# Altium schematic sheet 17_CAM_Connector.SchDoc: C200
size 594 x 420 mm; Page Create Date: March  8, 1995; Page Number: 17; Page Size: A2; Comment: radxa_1010; Page Count: 21; RevCode: V1.11; Doc: 17_CAM_Connector; DsnPath: D:\WMS\C200\CC122\对外\C200 V1.11.DSN; SchematicName: c200; PageName: 17_CAM_Connector; PageSize: A2; TopSchematic: True
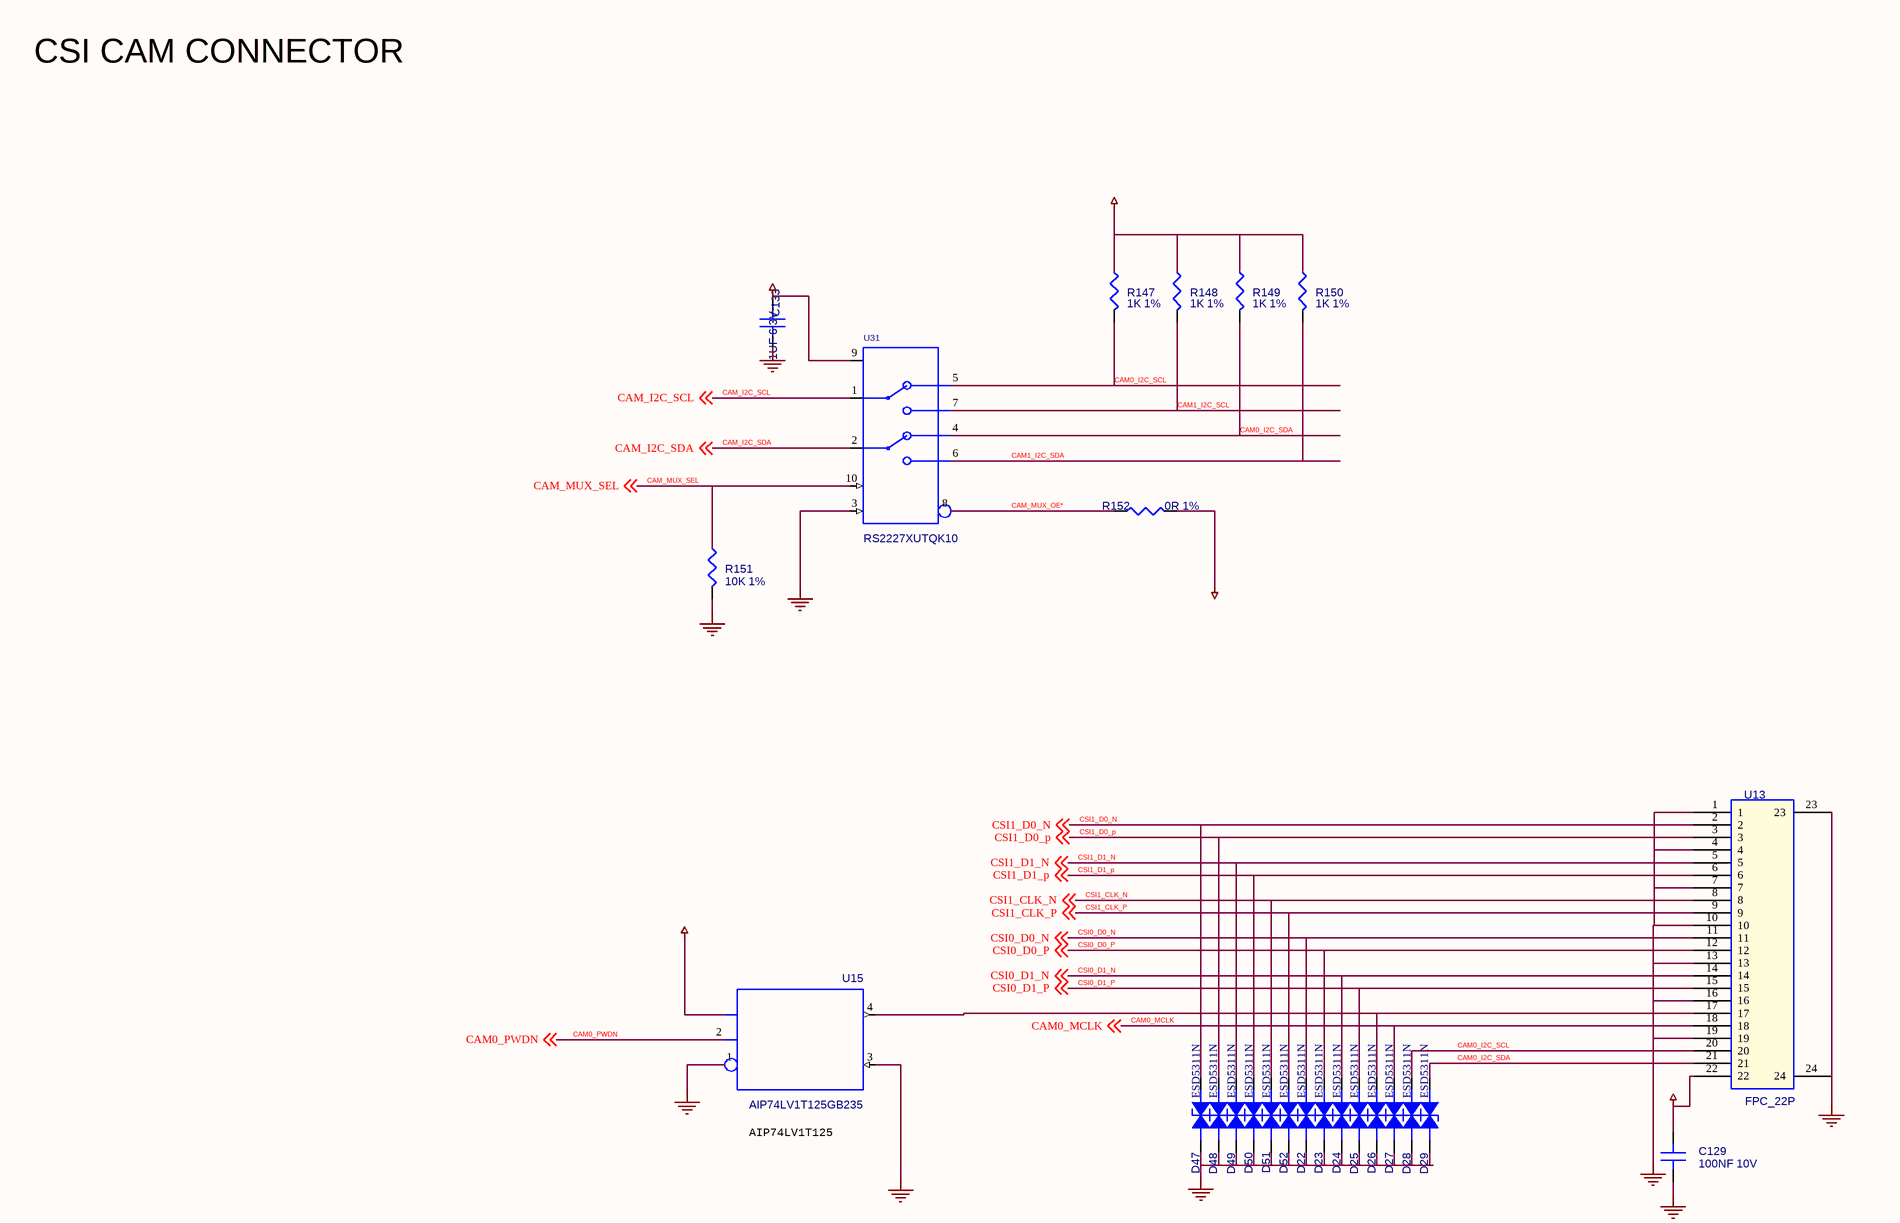
[diagram p0: 17_CAM_Connector.SchDoc, top left]
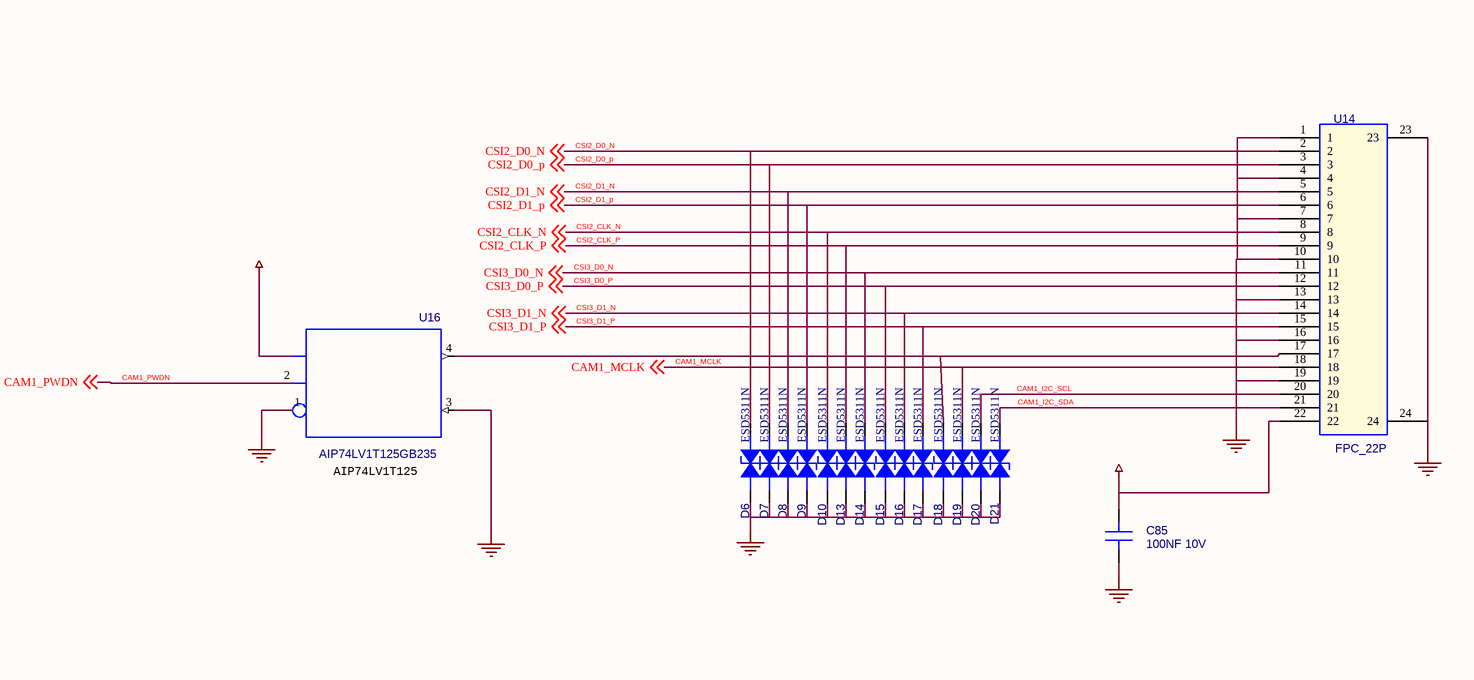
[diagram p1: 17_CAM_Connector.SchDoc, bottom left]
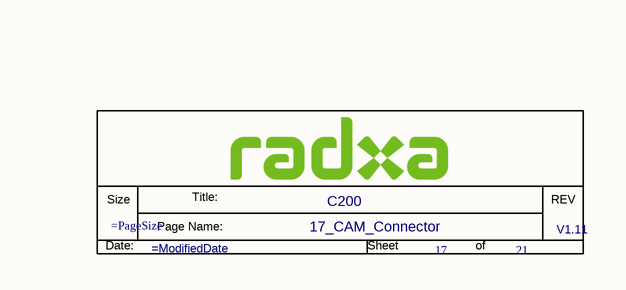
[diagram p2: 17_CAM_Connector.SchDoc, bottom right]

## Parts
*  Doc: 17_CAM_Connector  RevCode: V1.11  Title: C200  Page Number: 17  Page Count: 21  (hidden comment: radxa_1010)  (graphical)
C85  100NF 10V  [C0402]
C129  100NF 10V  [C0402]
C133  1UF 6.3V  [C0201]
D6  ESD5311N  [DFN1006-2L]
D7  ESD5311N  [DFN1006-2L]
D8  ESD5311N  [DFN1006-2L]
D9  ESD5311N  [DFN1006-2L]
D10  ESD5311N  [DFN1006-2L]
D13  ESD5311N  [DFN1006-2L]
D14  ESD5311N  [DFN1006-2L]
D15  ESD5311N  [DFN1006-2L]
D16  ESD5311N  [DFN1006-2L]
D17  ESD5311N  [DFN1006-2L]
D18  ESD5311N  [DFN1006-2L]
D19  ESD5311N  [DFN1006-2L]
D20  ESD5311N  [DFN1006-2L]
D21  ESD5311N  [DFN1006-2L]
D22  ESD5311N  [DFN1006-2L]
D23  ESD5311N  [DFN1006-2L]
D24  ESD5311N  [DFN1006-2L]
D25  ESD5311N  [DFN1006-2L]
D26  ESD5311N  [DFN1006-2L]
D27  ESD5311N  [DFN1006-2L]
D28  ESD5311N  [DFN1006-2L]
D29  ESD5311N  [DFN1006-2L]
D47  ESD5311N  [DFN1006-2L]
D48  ESD5311N  [DFN1006-2L]
D49  ESD5311N  [DFN1006-2L]
D50  ESD5311N  [DFN1006-2L]
D51  ESD5311N  [DFN1006-2L]
D52  ESD5311N  [DFN1006-2L]
R147  1K 1%  [R0402]
R148  1K 1%  [R0402]
R149  1K 1%  [R0402]
R150  1K 1%  [R0402]
R151  10K 1%  [R0402]
R152  0R 1%  [R0402]
U13  FPC_22P  [FPC_22_0D5_LIE_FG]
U14  FPC_22P  [FPC_22_0D5_LIE_FG]
U15  AIP74LV1T125GB235  [SC70_5]
U16  AIP74LV1T125GB235  [SC70_5]
U31  RS2227XUTQK10  [QFN10_0D4_1D4]

## Nets
GND: C85.2(B) C129.2(B) C133.2(B) D6.2(CATHODE) D7.2(CATHODE) D8.2(CATHODE) D9.2(CATHODE) D10.2(CATHODE) D13.2(CATHODE) D14.2(CATHODE) D15.2(CATHODE) D16.2(CATHODE) D17.2(CATHODE) D18.2(CATHODE) D19.2(CATHODE) D20.2(CATHODE) D21.2(CATHODE) D22.2(CATHODE) D23.2(CATHODE) D24.2(CATHODE) D25.2(CATHODE) D26.2(CATHODE) D27.2(CATHODE) D28.2(CATHODE) D29.2(CATHODE) D47.2(CATHODE) D48.2(CATHODE) D49.2(CATHODE) D50.2(CATHODE) D51.2(CATHODE) D52.2(CATHODE) R151.2 R152.2 U13.1 U13.4 U13.7 U13.10 U13.13 U13.16 U13.19 U13.23 U13.24 U14.1 U14.4 U14.7 U14.10 U14.13 U14.16 U14.19 U14.23 U14.24 U15.1(OE*) U15.3(GND) U16.1(OE*) U16.3(GND) U31.3(GND)
VCC: U15.5(VCC) U16.5(VCC)
VDD_3V3_SYS: C85.1(A) C129.1(A) C133.1(A) R147.1 R148.1 R149.1 R150.1 U13.22 U14.22 U31.9(VCC)
CAM0_I2C_SCL: D28.1(ANODE) R147.2 U13.20 U31.5(HSD1P)
CAM0_I2C_SDA: D29.1(ANODE) R149.2 U13.21 U31.4(HSD1N)
CAM0_MCLK: D27.1(ANODE) U13.18 ; off-sheet CAM0_MCLK
CAM0_PWDN: U15.2(IN) ; off-sheet CAM0_PWDN
CAM1_I2C_SCL: D20.1(ANODE) R148.2 U14.20 U31.7(HSD2P)
CAM1_I2C_SDA: D21.1(ANODE) R150.2 U14.21 U31.6(HSD2N)
CAM1_MCLK: D19.1(ANODE) U14.18 ; off-sheet CAM1_MCLK
CAM1_PWDN: U16.2(IN) ; off-sheet CAM1_PWDN
CAM_I2C_SCL: U31.1(DP) ; off-sheet CAM_I2C_SCL
CAM_I2C_SDA: U31.2(DN) ; off-sheet CAM_I2C_SDA
CAM_MUX_OE*: R152.1 U31.8(OE*)
CAM_MUX_SEL: R151.1 U31.10(S) ; off-sheet CAM_MUX_SEL
CSI0_D0_N: D22.1(ANODE) U13.11 ; off-sheet CSI0_D0_N
CSI0_D0_P: D23.1(ANODE) U13.12 ; off-sheet CSI0_D0_P
CSI0_D1_N: D24.1(ANODE) U13.14 ; off-sheet CSI0_D1_N
CSI0_D1_P: D25.1(ANODE) U13.15 ; off-sheet CSI0_D1_P
CSI1_CLK_N: D51.1(ANODE) U13.8 ; off-sheet CSI1_CLK_N
CSI1_CLK_P: D52.1(ANODE) U13.9 ; off-sheet CSI1_CLK_P
CSI1_D0_N: D47.1(ANODE) U13.2 ; off-sheet CSI1_D0_N
CSI1_D0_p: D48.1(ANODE) U13.3 ; off-sheet CSI1_D0_p
CSI1_D1_N: D49.1(ANODE) U13.5 ; off-sheet CSI1_D1_N
CSI1_D1_p: D50.1(ANODE) U13.6 ; off-sheet CSI1_D1_p
CSI2_CLK_N: D10.1(ANODE) U14.8 ; off-sheet CSI2_CLK_N
CSI2_CLK_P: D13.1(ANODE) U14.9 ; off-sheet CSI2_CLK_P
CSI2_D0_N: D6.1(ANODE) U14.2 ; off-sheet CSI2_D0_N
CSI2_D0_p: D7.1(ANODE) U14.3 ; off-sheet CSI2_D0_p
CSI2_D1_N: D8.1(ANODE) U14.5 ; off-sheet CSI2_D1_N
CSI2_D1_p: D9.1(ANODE) U14.6 ; off-sheet CSI2_D1_p
CSI3_D0_N: D14.1(ANODE) U14.11 ; off-sheet CSI3_D0_N
CSI3_D0_P: D15.1(ANODE) U14.12 ; off-sheet CSI3_D0_P
CSI3_D1_N: D16.1(ANODE) U14.14 ; off-sheet CSI3_D1_N
CSI3_D1_P: D17.1(ANODE) U14.15 ; off-sheet CSI3_D1_P
NetD18_1: D18.1(ANODE) U14.17 U16.4(OUT)
NetD26_1: D26.1(ANODE) U13.17 U15.4(OUT)

## Notes on the sheet
- CSI CAM CONNECTOR
- AIP74LV1T125
- (in symbol radxa_1010) Size; Title:; REV; Page Name:; Date:; Sheet; of

## Library data of the parts
C85 = C: SMD  0402  100NF  10V  X5R  ±10%  ROHS; PARTS: 1; Part Reference: C85; Part Number: A1C01.00163; OriginalSymbolOrigin: (0,30); PKG_TYPE: CAP2-100-250; LEVEL: STD; PINSWAP: (A,B); Value: 100NF 10V; Part Type: 陶瓷电容; PCB Footprint: C0402
C129 = C: SMD  0402  100NF  10V  X5R  ±10%  ROHS; PARTS: 1; Part Reference: C129; Part Number: A1C01.00163; OriginalSymbolOrigin: (0,30); PKG_TYPE: CAP2-100-250; LEVEL: STD; PINSWAP: (A,B); Value: 100NF 10V; Part Type: 陶瓷电容; PCB Footprint: C0402
C133 = C: SMD  0201  1UF  6.3V  X5R  ±20%  ROHS; PARTS: 1; Part Reference: C133; Part Number: A1C01.00083; OriginalSymbolOrigin: (0,30); PKG_TYPE: CAP2-100-250; LEVEL: STD; PINSWAP: (A,B); Value: 1UF 6.3V; Part Type: 陶瓷电容; PCB Footprint: C0201
D6 = ESD: SMD  编带  DFN1006-2L  ESD5311N-2/TR  双向TVS  VRWM=5V  0.25pF  84W  WILLSEMI(韦尔)  ROHS; Part Reference: D6; Part Number: A1D02.00001; Parameter: ESD-台舟 ESD5341N-封装 esd0402; Temp Coeff: -40℃ to +125℃; Value: ESD5311N; Part Type: 二极管-ESD管-桥堆-TVS管; PCB Footprint: DFN1006-2L
D7 = ESD: SMD  编带  DFN1006-2L  ESD5311N-2/TR  双向TVS  VRWM=5V  0.25pF  84W  WILLSEMI(韦尔)  ROHS; Part Reference: D7; Part Number: A1D02.00001; Parameter: ESD-台舟 ESD5341N-封装 esd0402; ID: DE-E0004; Temp Coeff: -40℃ to +125℃; Value: ESD5311N; Part Type: 二极管-ESD管-桥堆-TVS管; PCB Footprint: DFN1006-2L
D8 = ESD: SMD  编带  DFN1006-2L  ESD5311N-2/TR  双向TVS  VRWM=5V  0.25pF  84W  WILLSEMI(韦尔)  ROHS; Part Reference: D8; Part Number: A1D02.00001; Parameter: ESD-台舟 ESD5341N-封装 esd0402; ID: DE-E0004; Temp Coeff: -40℃ to +125℃; Value: ESD5311N; Part Type: 二极管-ESD管-桥堆-TVS管; PCB Footprint: DFN1006-2L
D9 = ESD: SMD  编带  DFN1006-2L  ESD5311N-2/TR  双向TVS  VRWM=5V  0.25pF  84W  WILLSEMI(韦尔)  ROHS; Part Reference: D9; Part Number: A1D02.00001; Parameter: ESD-台舟 ESD5341N-封装 esd0402; ID: DE-E0004; Temp Coeff: -40℃ to +125℃; Value: ESD5311N; Part Type: 二极管-ESD管-桥堆-TVS管; PCB Footprint: DFN1006-2L
D10 = ESD: SMD  编带  DFN1006-2L  ESD5311N-2/TR  双向TVS  VRWM=5V  0.25pF  84W  WILLSEMI(韦尔)  ROHS; Part Reference: D10; Part Number: A1D02.00001; Parameter: ESD-台舟 ESD5341N-封装 esd0402; Temp Coeff: -40℃ to +125℃; Value: ESD5311N; Part Type: 二极管-ESD管-桥堆-TVS管; PCB Footprint: DFN1006-2L
D13 = ESD: SMD  编带  DFN1006-2L  ESD5311N-2/TR  双向TVS  VRWM=5V  0.25pF  84W  WILLSEMI(韦尔)  ROHS; Part Reference: D13; Part Number: A1D02.00001; Parameter: ESD-台舟 ESD5341N-封装 esd0402; ID: DE-E0004; Temp Coeff: -40℃ to +125℃; Value: ESD5311N; Part Type: 二极管-ESD管-桥堆-TVS管; PCB Footprint: DFN1006-2L
D14 = ESD: SMD  编带  DFN1006-2L  ESD5311N-2/TR  双向TVS  VRWM=5V  0.25pF  84W  WILLSEMI(韦尔)  ROHS; Part Reference: D14; Part Number: A1D02.00001; Parameter: ESD-台舟 ESD5341N-封装 esd0402; ID: DE-E0004; Temp Coeff: -40℃ to +125℃; Value: ESD5311N; Part Type: 二极管-ESD管-桥堆-TVS管; PCB Footprint: DFN1006-2L
D15 = ESD: SMD  编带  DFN1006-2L  ESD5311N-2/TR  双向TVS  VRWM=5V  0.25pF  84W  WILLSEMI(韦尔)  ROHS; Part Reference: D15; Part Number: A1D02.00001; Parameter: ESD-台舟 ESD5341N-封装 esd0402; Temp Coeff: -40℃ to +125℃; Value: ESD5311N; Part Type: 二极管-ESD管-桥堆-TVS管; PCB Footprint: DFN1006-2L
D16 = ESD: SMD  编带  DFN1006-2L  ESD5311N-2/TR  双向TVS  VRWM=5V  0.25pF  84W  WILLSEMI(韦尔)  ROHS; Part Reference: D16; Part Number: A1D02.00001; Parameter: ESD-台舟 ESD5341N-封装 esd0402; ID: DE-E0004; Temp Coeff: -40℃ to +125℃; Value: ESD5311N; Part Type: 二极管-ESD管-桥堆-TVS管; PCB Footprint: DFN1006-2L
D17 = ESD: SMD  编带  DFN1006-2L  ESD5311N-2/TR  双向TVS  VRWM=5V  0.25pF  84W  WILLSEMI(韦尔)  ROHS; Part Reference: D17; Part Number: A1D02.00001; Parameter: ESD-台舟 ESD5341N-封装 esd0402; ID: DE-E0004; Temp Coeff: -40℃ to +125℃; Value: ESD5311N; Part Type: 二极管-ESD管-桥堆-TVS管; PCB Footprint: DFN1006-2L
D18 = ESD: SMD  编带  DFN1006-2L  ESD5311N-2/TR  双向TVS  VRWM=5V  0.25pF  84W  WILLSEMI(韦尔)  ROHS; Part Reference: D18; Part Number: A1D02.00001; Parameter: ESD-台舟 ESD5341N-封装 esd0402; Temp Coeff: -40℃ to +125℃; Value: ESD5311N; Part Type: 二极管-ESD管-桥堆-TVS管; PCB Footprint: DFN1006-2L
D19 = ESD: SMD  编带  DFN1006-2L  ESD5311N-2/TR  双向TVS  VRWM=5V  0.25pF  84W  WILLSEMI(韦尔)  ROHS; Part Reference: D19; Part Number: A1D02.00001; Parameter: ESD-台舟 ESD5341N-封装 esd0402; ID: DE-E0004; Temp Coeff: -40℃ to +125℃; Value: ESD5311N; Part Type: 二极管-ESD管-桥堆-TVS管; PCB Footprint: DFN1006-2L
D20 = ESD: SMD  编带  DFN1006-2L  ESD5311N-2/TR  双向TVS  VRWM=5V  0.25pF  84W  WILLSEMI(韦尔)  ROHS; Part Reference: D20; Part Number: A1D02.00001; Parameter: ESD-台舟 ESD5341N-封装 esd0402; Temp Coeff: -40℃ to +125℃; Value: ESD5311N; Part Type: 二极管-ESD管-桥堆-TVS管; PCB Footprint: DFN1006-2L
D21 = ESD: SMD  编带  DFN1006-2L  ESD5311N-2/TR  双向TVS  VRWM=5V  0.25pF  84W  WILLSEMI(韦尔)  ROHS; Part Reference: D21; Part Number: A1D02.00001; Parameter: ESD-台舟 ESD5341N-封装 esd0402; ID: DE-E0004; Temp Coeff: -40℃ to +125℃; Value: ESD5311N; Part Type: 二极管-ESD管-桥堆-TVS管; PCB Footprint: DFN1006-2L
D22 = ESD: SMD  编带  DFN1006-2L  ESD5311N-2/TR  双向TVS  VRWM=5V  0.25pF  84W  WILLSEMI(韦尔)  ROHS; Part Reference: D22; Part Number: A1D02.00001; Parameter: ESD-台舟 ESD5341N-封装 esd0402; Temp Coeff: -40℃ to +125℃; Value: ESD5311N; Part Type: 二极管-ESD管-桥堆-TVS管; PCB Footprint: DFN1006-2L
D23 = ESD: SMD  编带  DFN1006-2L  ESD5311N-2/TR  双向TVS  VRWM=5V  0.25pF  84W  WILLSEMI(韦尔)  ROHS; Part Reference: D23; Part Number: A1D02.00001; Parameter: ESD-台舟 ESD5341N-封装 esd0402; ID: DE-E0004; Temp Coeff: -40℃ to +125℃; Value: ESD5311N; Part Type: 二极管-ESD管-桥堆-TVS管; PCB Footprint: DFN1006-2L
D24 = ESD: SMD  编带  DFN1006-2L  ESD5311N-2/TR  双向TVS  VRWM=5V  0.25pF  84W  WILLSEMI(韦尔)  ROHS; Part Reference: D24; Part Number: A1D02.00001; Parameter: ESD-台舟 ESD5341N-封装 esd0402; ID: DE-E0004; Temp Coeff: -40℃ to +125℃; Value: ESD5311N; Part Type: 二极管-ESD管-桥堆-TVS管; PCB Footprint: DFN1006-2L
D25 = ESD: SMD  编带  DFN1006-2L  ESD5311N-2/TR  双向TVS  VRWM=5V  0.25pF  84W  WILLSEMI(韦尔)  ROHS; Part Reference: D25; Part Number: A1D02.00001; Parameter: ESD-台舟 ESD5341N-封装 esd0402; ID: DE-E0004; Temp Coeff: -40℃ to +125℃; Value: ESD5311N; Part Type: 二极管-ESD管-桥堆-TVS管; PCB Footprint: DFN1006-2L
D26 = ESD: SMD  编带  DFN1006-2L  ESD5311N-2/TR  双向TVS  VRWM=5V  0.25pF  84W  WILLSEMI(韦尔)  ROHS; Part Reference: D26; Part Number: A1D02.00001; Parameter: ESD-台舟 ESD5341N-封装 esd0402; Temp Coeff: -40℃ to +125℃; Value: ESD5311N; Part Type: 二极管-ESD管-桥堆-TVS管; PCB Footprint: DFN1006-2L
D27 = ESD: SMD  编带  DFN1006-2L  ESD5311N-2/TR  双向TVS  VRWM=5V  0.25pF  84W  WILLSEMI(韦尔)  ROHS; Part Reference: D27; Part Number: A1D02.00001; Parameter: ESD-台舟 ESD5341N-封装 esd0402; ID: DE-E0004; Temp Coeff: -40℃ to +125℃; Value: ESD5311N; Part Type: 二极管-ESD管-桥堆-TVS管; PCB Footprint: DFN1006-2L
D28 = ESD: SMD  编带  DFN1006-2L  ESD5311N-2/TR  双向TVS  VRWM=5V  0.25pF  84W  WILLSEMI(韦尔)  ROHS; Part Reference: D28; Part Number: A1D02.00001; Parameter: ESD-台舟 ESD5341N-封装 esd0402; Temp Coeff: -40℃ to +125℃; Value: ESD5311N; Part Type: 二极管-ESD管-桥堆-TVS管; PCB Footprint: DFN1006-2L
D29 = ESD: SMD  编带  DFN1006-2L  ESD5311N-2/TR  双向TVS  VRWM=5V  0.25pF  84W  WILLSEMI(韦尔)  ROHS; Part Reference: D29; Part Number: A1D02.00001; Parameter: ESD-台舟 ESD5341N-封装 esd0402; ID: DE-E0004; Temp Coeff: -40℃ to +125℃; Value: ESD5311N; Part Type: 二极管-ESD管-桥堆-TVS管; PCB Footprint: DFN1006-2L
D47 = ESD: SMD  编带  DFN1006-2L  ESD5311N-2/TR  双向TVS  VRWM=5V  0.25pF  84W  WILLSEMI(韦尔)  ROHS; Part Reference: D47; Part Number: A1D02.00001; Parameter: ESD-台舟 ESD5341N-封装 esd0402; Temp Coeff: -40℃ to +125℃; Value: ESD5311N; Part Type: 二极管-ESD管-桥堆-TVS管; PCB Footprint: DFN1006-2L
D48 = ESD: SMD  编带  DFN1006-2L  ESD5311N-2/TR  双向TVS  VRWM=5V  0.25pF  84W  WILLSEMI(韦尔)  ROHS; Part Reference: D48; Part Number: A1D02.00001; Parameter: ESD-台舟 ESD5341N-封装 esd0402; ID: DE-E0004; Temp Coeff: -40℃ to +125℃; Value: ESD5311N; Part Type: 二极管-ESD管-桥堆-TVS管; PCB Footprint: DFN1006-2L
D49 = ESD: SMD  编带  DFN1006-2L  ESD5311N-2/TR  双向TVS  VRWM=5V  0.25pF  84W  WILLSEMI(韦尔)  ROHS; Part Reference: D49; Part Number: A1D02.00001; Parameter: ESD-台舟 ESD5341N-封装 esd0402; ID: DE-E0004; Temp Coeff: -40℃ to +125℃; Value: ESD5311N; Part Type: 二极管-ESD管-桥堆-TVS管; PCB Footprint: DFN1006-2L
D50 = ESD: SMD  编带  DFN1006-2L  ESD5311N-2/TR  双向TVS  VRWM=5V  0.25pF  84W  WILLSEMI(韦尔)  ROHS; Part Reference: D50; Part Number: A1D02.00001; Parameter: ESD-台舟 ESD5341N-封装 esd0402; ID: DE-E0004; Temp Coeff: -40℃ to +125℃; Value: ESD5311N; Part Type: 二极管-ESD管-桥堆-TVS管; PCB Footprint: DFN1006-2L
D51 = ESD: SMD  编带  DFN1006-2L  ESD5311N-2/TR  双向TVS  VRWM=5V  0.25pF  84W  WILLSEMI(韦尔)  ROHS; Part Reference: D51; Part Number: A1D02.00001; Parameter: ESD-台舟 ESD5341N-封装 esd0402; Temp Coeff: -40℃ to +125℃; Value: ESD5311N; Part Type: 二极管-ESD管-桥堆-TVS管; PCB Footprint: DFN1006-2L
D52 = ESD: SMD  编带  DFN1006-2L  ESD5311N-2/TR  双向TVS  VRWM=5V  0.25pF  84W  WILLSEMI(韦尔)  ROHS; Part Reference: D52; Part Number: A1D02.00001; Parameter: ESD-台舟 ESD5341N-封装 esd0402; ID: DE-E0004; Temp Coeff: -40℃ to +125℃; Value: ESD5311N; Part Type: 二极管-ESD管-桥堆-TVS管; PCB Footprint: DFN1006-2L
R147 = R: SMD  0201  1K  1/20W  ±1%  ROHS; Part Reference: R147; Part Number: A1R01.00111; CDS_PART_NAME: R_0402-47K,5 %,62.5MW,195-0599-000; CDS_PHYS_PART_NAME: R_0402-47K,5 %,62.5MW,195-0599-000-195-0599-000,47K; PCB Footprint: R0201; ASSEMBLY: CAM; CDS_LIB: discrete; CDS_SEC: 1; DEVICE_TYPENAME: R_0402-47K5625MW195-0599-000-195-0599-00047K; DRAWING: @P3449_B01_LIB.P3449_B01(SCH_1):PAGE18; MAX_WATTAGE: 62.5mW; NV_PN: 195-0599-000; PACK_TYPE: 402; PATH: I86; PHYS_PAGE: 18; ROT: 0; SIGNAL_MODEL: nv_res; TOL: 5%; VER: 2; XY: (-9200,2300); Value: 1K 1%; Part Type: 贴片电阻; CHIPS_PART_NAME: R; SEC: 1
R148 = R: SMD  0201  1K  1/20W  ±1%  ROHS; Part Reference: R148; CDS_PHYS_PART_NAME: R_0402-47K,5 %,62.5MW,195-0599-000-195-0599-000,47K; CDS_PART_NAME: R_0402-47K,5 %,62.5MW,195-0599-000; Part Number: A1R01.00111; PCB Footprint: R0201; SEC: 1; XY: (-8950,2300); VER: 2; TOL: 5%; SIGNAL_MODEL: nv_res; ROT: 0; PHYS_PAGE: 18; PATH: I87; PACK_TYPE: 402; NV_PN: 195-0599-000; MAX_WATTAGE: 62.5mW; DRAWING: @P3449_B01_LIB.P3449_B01(SCH_1):PAGE18; DEVICE_TYPENAME: R_0402-47K5625MW195-0599-000-195-0599-00047K; CDS_LIB: discrete; ASSEMBLY: CAM; Value: 1K 1%; CHIPS_PART_NAME: R; CDS_SEC: 1; Part Type: 贴片电阻
R149 = R: SMD  0201  1K  1/20W  ±1%  ROHS; Part Reference: R149; CDS_PHYS_PART_NAME: R_0402-47K,5 %,62.5MW,195-0599-000-195-0599-000,47K; CDS_PART_NAME: R_0402-47K,5 %,62.5MW,195-0599-000; Part Number: A1R01.00111; PCB Footprint: R0201; SEC: 1; XY: (-8700,2300); VER: 2; TOL: 5%; SIGNAL_MODEL: nv_res; ROT: 0; PHYS_PAGE: 18; PATH: I88; PACK_TYPE: 402; NV_PN: 195-0599-000; MAX_WATTAGE: 62.5mW; DRAWING: @P3449_B01_LIB.P3449_B01(SCH_1):PAGE18; DEVICE_TYPENAME: R_0402-47K5625MW195-0599-000-195-0599-00047K; CDS_LIB: discrete; ASSEMBLY: CAM; Value: 1K 1%; CHIPS_PART_NAME: R; CDS_SEC: 1; Part Type: 贴片电阻
R150 = R: SMD  0201  1K  1/20W  ±1%  ROHS; Part Reference: R150; CDS_PHYS_PART_NAME: R_0402-47K,5 %,62.5MW,195-0599-000-195-0599-000,47K; CDS_PART_NAME: R_0402-47K,5 %,62.5MW,195-0599-000; Part Number: A1R01.00111; PCB Footprint: R0201; SEC: 1; XY: (-8450,2300); VER: 2; TOL: 5%; SIGNAL_MODEL: nv_res; ROT: 0; PHYS_PAGE: 18; PATH: I89; PACK_TYPE: 402; NV_PN: 195-0599-000; MAX_WATTAGE: 62.5mW; DRAWING: @P3449_B01_LIB.P3449_B01(SCH_1):PAGE18; DEVICE_TYPENAME: R_0402-47K5625MW195-0599-000-195-0599-00047K; CDS_LIB: discrete; ASSEMBLY: CAM; Value: 1K 1%; CHIPS_PART_NAME: R; CDS_SEC: 1; Part Type: 贴片电阻
R151 = R: SMD  0402  10K  1/16W  ±1%  ROHS; Part Reference: R151; Part Number: A1R01.00222; CDS_PART_NAME: R_0402-10K,5 %,62.5MW,195-0486-000; CDS_PHYS_PART_NAME: R_0402-10K,5 %,62.5MW,195-0486-000-10K,195-0486-000; ASSEMBLY: CAM; CDS_LIB: discrete; CDS_SEC: 1; DEVICE_TYPENAME: R_0402-10K5625MW195-0486-000-10K195-0486-000; DRAWING: @P3449_B01_LIB.P3449_B01(SCH_1):PAGE18; MAX_WATTAGE: 62.5mW; NV_PN: 195-0486-000; PACK_TYPE: 402; PATH: I92; PHYS_PAGE: 18; ROT: 0; SIGNAL_MODEL: nv_res; TOL: 5%; VER: 2; XY: (-10850,1350); PCB Footprint: R0402; Value: 10K 1%; Part Type: 贴片电阻; CHIPS_PART_NAME: R; SEC: 1
R152 = R: SMD  0402  0R  1/16W  ±1%  ROHS; Part Reference: R152; Part Number: A1R01.00219; PCB Footprint: R0402; Value: 0R 1%; Part Type: 贴片电阻
U13 = FPC_22P: Part Reference: U13; PCB Footprint: FPC_22_0D5_LIE; Value: FPC_22P
U14 = FPC_22P: Part Reference: U14; PCB Footprint: FPC_22_0D5_LIE; Value: FPC_22P
U15 = 74LVC1G125GW_125: SMD  缓冲器/驱动器  AIP74LV1T125GB235.TR  SOT23-5  I-CORE(中微爱芯)  ROHS; Part Reference: U15; Part Number: A1I01.01025; OriginalSymbolOrigin: (-300,200); Preferred: 优选; ASSEMBLY: ?; FUNCTION: ?; NV_NAME: ?; NV_PN: ?; PACK_TYPE: ?; PATH: ?; PLACEMENT_NOTE: ?; SKU: COMMON; Value: AIP74LV1T125GB235; Part Type: 集成电路/模块; PCB Footprint: SC70_5
U16 = 74LVC1G125GW_125: SMD  缓冲器/驱动器  AIP74LV1T125GB235.TR  SOT23-5  I-CORE(中微爱芯)  ROHS; Part Reference: U16; Part Number: A1I01.01025; OriginalSymbolOrigin: (-300,200); Preferred: 优选; ASSEMBLY: ?; FUNCTION: ?; NV_NAME: ?; NV_PN: ?; PACK_TYPE: ?; PATH: ?; PLACEMENT_NOTE: ?; SKU: COMMON; Value: AIP74LV1T125GB235; Part Type: 集成电路/模块; PCB Footprint: SC70_5
U31 = RS2227XUTQK10: SMD  模拟开关/多路复用器  RS2227XUTQK10  QFN-1.4x1.8-10L  RUNIC(润石)  ROHS; Part Reference: U31; Part Number: A1I01.00774; SYM4PACK_TYPE: UQFN10; OriginalSymbolOrigin: (-200,350); Temp Coeff: -40°C to +85°C; ASSEMBLY: ?; FUNCTION: ?; NV_NAME: ?; NV_PN: ?; PACK_TYPE: ?; PATH: ?; PLACEMENT_NOTE: ?; SKU: COMMON; Value: RS2227XUTQK10; Part Type: 集成电路/模块; PCB Footprint: QFN10_0D4_1D4
* = radxa_1010: Page Create Date: March  8, 1995; Page Size: =PageSize; Page Modify Date: =ModifiedDate